# Altium schematic sheet Battery Charger Circuit.SchDoc
size A; SheetNumber: 1; SheetTotal: 1
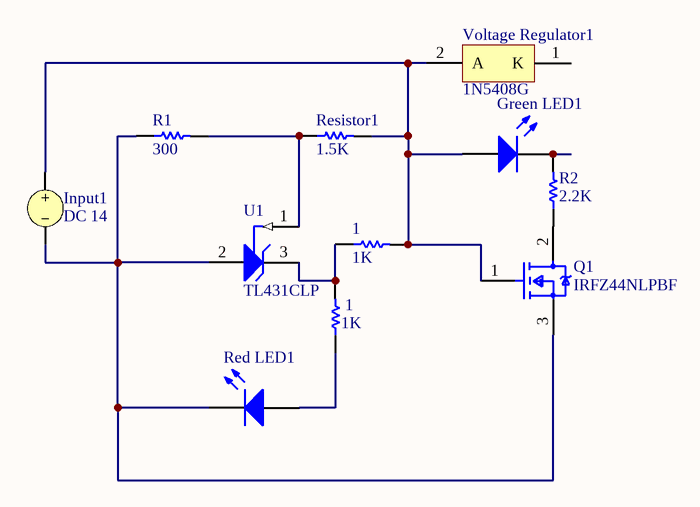
[diagram p0: Battery Charger Circuit.SchDoc]

## Parts
1  value 1K  (hidden comment: Resistor)
1  value 1K  (hidden comment: Resistor)
Green_LED1  Light-Emitting Diode  (value not drawn)
Input1  DC 14
Q1  IRFZ44NLPBF  [FP-PG-TO262-3-MFG]
R1  value 300  (hidden comment: Resistor)
R2  value 2.2K  (hidden comment: Resistor)
Red_LED1  Light-Emitting Diode  (value not drawn)
Resistor1  value 1.5K  (hidden comment: Resistor)
U1  TL431CLP  [LP0003A]
Voltage_Regulator1  1N5408G  [ONSC-AXIAL_LEAD-2-267-05_V]

## Nets
Net1_1: 1.1 1.2 U1.3(CATHODE)
Net1_1: 1.1 Red_LED1.1(A)  [a separate net that carries the same name]
Net1_2: 1.2 Green_LED1.1(A) Input1.1 Q1.1(G) Resistor1.2 Voltage_Regulator1.2(A)
NetGreen_LED1_2: Green_LED1.2(K) R2.2
NetInput1_2: Input1.2 Q1.3(S) R1.1 Red_LED1.2(K) U1.2(ANODE)
NetQ1_2: Q1.2(D) R2.1
NetR1_2: R1.2 Resistor1.1 U1.1(REF)

Not connected (* = marked no-connect by the designer): Voltage_Regulator1 1(K)

## Library data of the parts
1 1 R1 R2 Resistor1 = Resistor: TC1: 0; SimulationGenericComponent: True; TC2: 0
Green_LED1 Red_LED1 = LED: AF: 1; BV: 0; BV_MAX: 1e99; EG: 1.11; FC: 0.5; IBV: 0.001; IS: 1e-14; MJSW: 0.33; NTUN: 30; TNOM: 27; XTI: 3; SimulationGenericComponent: True; CJO: 0; CJP: 0; CTA: 0; CTP: 0; FCS: 0.5; FV_MAX: 1e99; IKF: 0; IKR: 0; ISR: 1e-14; JSW: 0; JTUN: 0; JTUNSW: 0; KEG: 1; KF: 0; LEVEL: 1; N: 1; NBV: 1; NR: 1; NS: 1; PHP: 1; RS: 0; TCV: 0; TLEV: 0; TLEVC: 0; TM1: 0; TM2: 0; TPB: 0; TPHP: 0; TRS: 0; TRS2: 0; TT: 0; TTT1: 0; TTT2: 0; VJ: 1; XTITUN: 3
Input1 = VSRC: Voltage Source; Note: PCB Footprint - Not required; AC Magnitude: 1; AC Phase: 0; Value: 14; Published: 8-Jun-2000; LatestRevisionDate: 17-Jul-2002; LatestRevisionNote: Re-released for DXP Platform.; PackageReference: Not Applicable; Publisher: Altium Limited
Q1 = CMP-00196-65874408-1: IRFZ44NLPBF Single N-Channel 55 V 17.5 mOhm 63 nC HEXFET® Power Mosfet - TO-262; Resistance: 17.5MΩ; Turn-On Delay Time: 12ns; Drain to Source Breakdown Voltage: 55V; Threshold Voltage: 4V; Rise Time: 60ns; Input Capacitance: 1.47nF; Power Dissipation: 110W; Max Junction Temperature (Tj): 175°C; Gate to Source Voltage (Vgs): 20V; Number of Channels: 1; Fall Time: 45ns; Max Power Dissipation: 3.8W; Continuous Drain Current (ID): 49A; Turn-Off Delay Time: 44ns; Case/Package: TO-262; Lifecycle Status: Production; Packaging: Bulk; RoHS: Compliant; Radiation Hardening: No; Height: 9.65mm; Voltage Rating (DC): 55V; On-State Resistance: 17.5mΩ; Width: 4.826mm; Mount: Through Hole; Max Operating Temperature: 175°C; Schedule B: 8541290080, 8541290080; Termination: Through Hole; Dual Supply Voltage: 55V; Package Quantity: 1000; Min Operating Temperature: -55°C; Lead Free: Contains Lead, Lead Free; Drain to Source Voltage (Vdss): 55V; Element Configuration: Single; Length: 10.668mm; Rds On Max: 17.5mΩ; Number of Pins: 3; Current Rating: 49A; REACH SVHC: No SVHC; Drain to Source Resistance: 17.5mΩ; NexarPartId: 65874408; Number of Elements: 1; Nominal Vgs: 4V
U1 = CMP-0366-00032-2: Adjustable Precision Shunt Regulator, 34 ppm / degC, 100 mA, 0 to 70 degC, 3-pin TO-92 (LP), Pb-Free (RoHS); Manufacturer: Texas Instruments; Iout/Iz(Max)(mA): 100; SubFamily: Shunt Voltage Reference; Initial Accuracy @ 25/deg C(%): 2; VO Adj(Max)(V): 36; Temp Coeff(Max)(ppm/ degree C): 92; Temp Coeff(Typ)(ppm/ degree C): 34; Min Iz for Regulation(uA): 600; VO Adj(Min)(V): 2.495; Rating: Military; ComponentLink2Description: Datasheet; PackageReference: LP0003A; ComponentLink1URL: http://www.ti.com/; PackageDescription: Plastic Cylindrical Package, Formed Lead Option (TO-92); Code_JEDEC: TO-226; PartNumber: TL431CLP; ComponentLink2URL: http://www.ti.com/general/docs/lit/getliterature.tsp?genericPartNumber=TL431&fileType=pdf; Eco-Plan: Pb-Free (RoHS); DatasheetVersion: SLVS543M; Mounting Technology: Through Hole; ComponentLink3Description: Package Specification; ComponentLink1Description: Manufacturer URL; PackageVersion: 4040001-2/C; ComponentLink3URL: http://www.ti.com/litv/pdf/msot002a
Voltage_Regulator1 = CMP-0902-00036-1: Standard Recovery Rectifier, 2-Pin Axial_Lead, Pb-Free, Bulk Box; Manufacturer: On Semiconductor; IO(rec) Max (A): 3; IFSM Max (A): 200; VRRM Max (V): 1000; Packing: Bulk Box; PartNumber: 1N5408G; ComponentLink3URL: http://www.onsemi.com/pub_link/Collateral/267-05.PDF; ComponentLink2Description: Datasheet; ComponentLink1URL: http://www.onsemi.com/; DatasheetVersion: Rev. 10; RoHS: TRUE; ComponentLink2URL: http://www.onsemi.com/pub_link/Collateral/1N5400-D.PDF; ComponentLink1Description: Manufacturer URL; ComponentLink3Description: Package Specification; Mounting Technology: Through Hole; Type: Standard Recovery; PackageReference: AXIAL_LEAD-2-267-05; PackageDescription: 2-Pin, Axial Lead, Diameter 5.05 mm; PackageVersion: Rev. G, 06/2000